# EasyEDA Pro project ProPrj_队内赛第二版_2024-09-21_20-05-29_2024-09-27.epro, schematic Schematic1
Board Name: Board1; Create Date: 2024-09-21
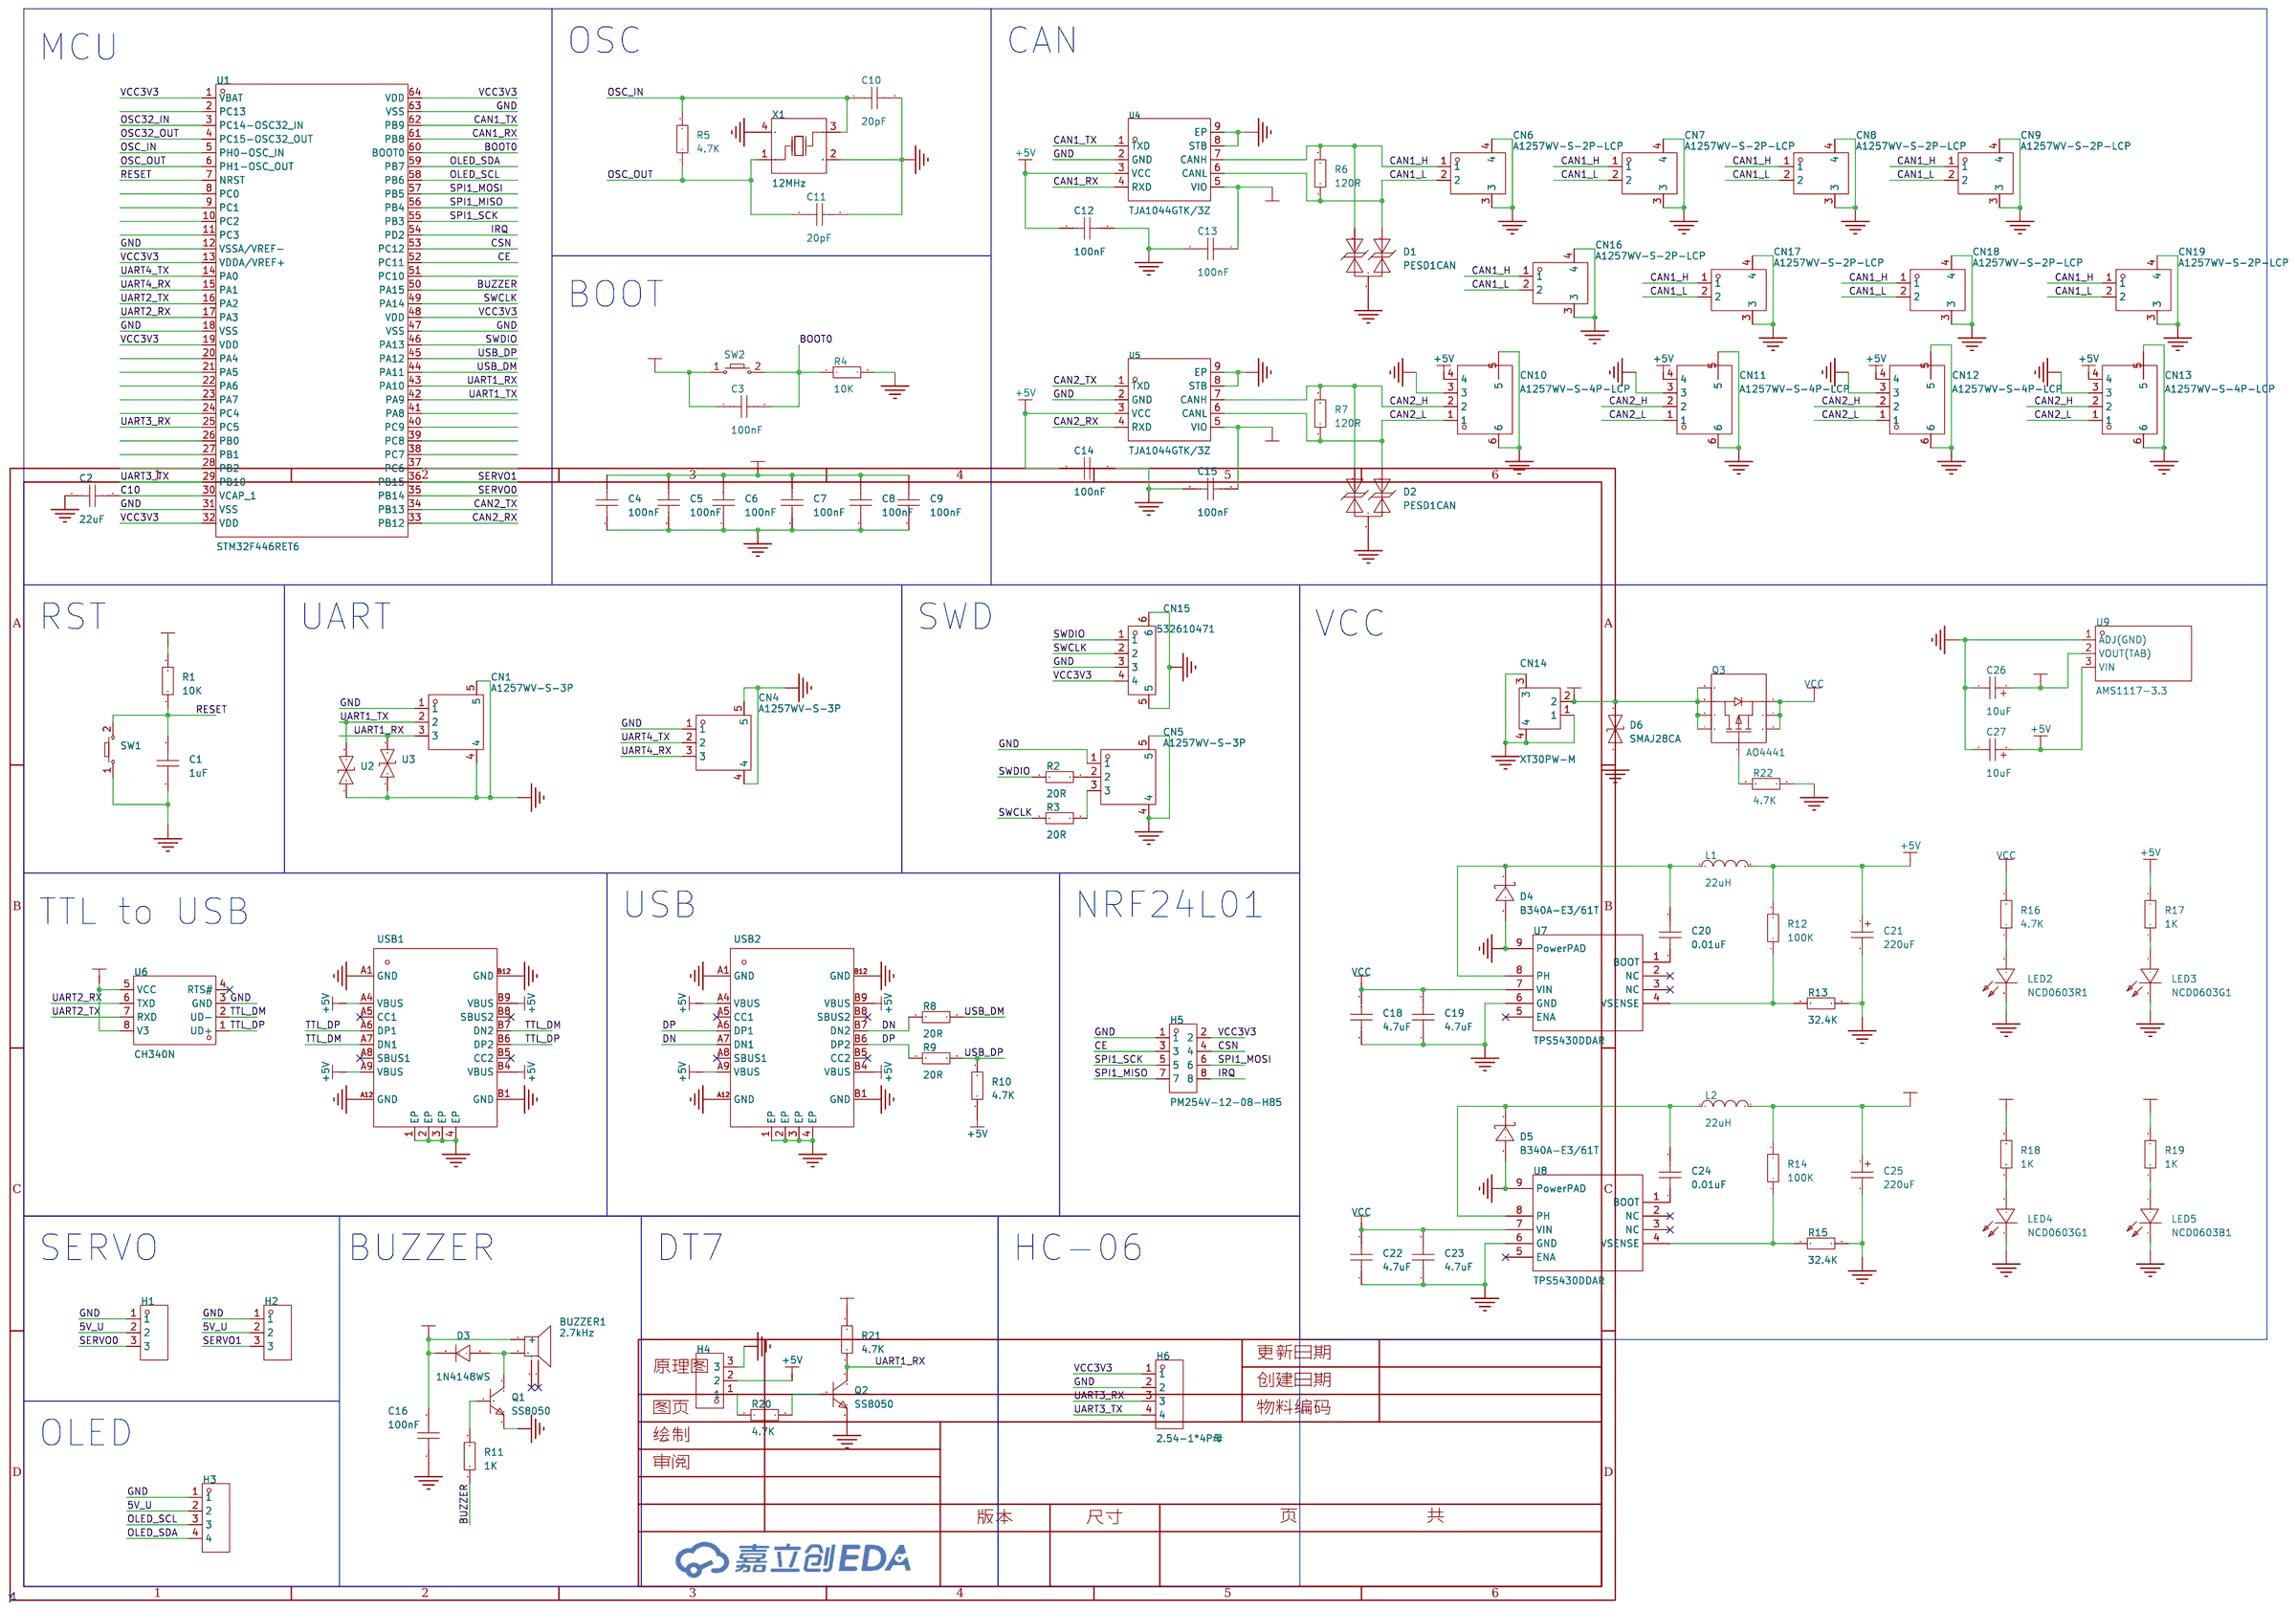
[diagram p0: schematic sheet]

## Parts
BUZZER1  2.7kHz  [BUZ-SMD_4P-L8.5-W8.5-P8.50-BR]
C1  1uF  [C0603]
C2  22uF  [C0603]
C3  100nF  [C0603]
C4  100nF  [C0603]
C5  100nF  [C0603]
C6  100nF  [C0603]
C7  100nF  [C0603]
C8  100nF  [C0603]
C9  100nF  [C0603]
C10  20pF  [C0603]
C11  20pF  [C0603]
C12  100nF  [C0603]
C13  100nF  [C0603]
C14  100nF  [C0603]
C15  100nF  [C0603]
C16  100nF  [C0603]
C18  4.7uF  [C0603]
C19  4.7uF  [C0603]
C20  0.01uF  [C0603]
C21  220uF  [CAP-SMD_BD6.3-L6.6-W6.6-FD]
C22  4.7uF  [C0603]
C23  4.7uF  [C0603]
C24  0.01uF  [C0603]
C25  220uF  [CAP-SMD_BD6.3-L6.6-W6.6-FD]
C26  10uF  [C0603]
C27  10uF  [C0603]
CN1  A1257WV-S-3P  [CONN-SMD_A1257WV-S-3P]
CN4  A1257WV-S-3P  [CONN-SMD_A1257WV-S-3P]
CN5  A1257WV-S-3P  [CONN-SMD_A1257WV-S-3P]
CN6  A1257WV-S-2P-LCP  [CONN-SMD_A1257WV-S-2P]
CN7  A1257WV-S-2P-LCP  [CONN-SMD_A1257WV-S-2P]
CN8  A1257WV-S-2P-LCP  [CONN-SMD_A1257WV-S-2P]
CN9  A1257WV-S-2P-LCP  [CONN-SMD_A1257WV-S-2P]
CN10  A1257WV-S-4P-LCP  [CONN-SMD_A1257WV-S-4P]
CN11  A1257WV-S-4P-LCP  [CONN-SMD_A1257WV-S-4P]
CN12  A1257WV-S-4P-LCP  [CONN-SMD_A1257WV-S-4P]
CN13  A1257WV-S-4P-LCP  [CONN-SMD_A1257WV-S-4P]
CN14  XT30PW-M  [CONN-TH_XT30PW-M]
CN15  532610471  [CONN-SMD_4P-P1.25_53261-0471]
CN16  A1257WV-S-2P-LCP  [CONN-SMD_A1257WV-S-2P]
CN17  A1257WV-S-2P-LCP  [CONN-SMD_A1257WV-S-2P]
CN18  A1257WV-S-2P-LCP  [CONN-SMD_A1257WV-S-2P]
CN19  A1257WV-S-2P-LCP  [CONN-SMD_A1257WV-S-2P]
D1  PESD1CAN  [SOT-23-3_L2.9-W1.6-P1.90-LS2.8-BR]
D2  PESD1CAN  [SOT-23-3_L2.9-W1.6-P1.90-LS2.8-BR]
D3  1N4148WS  [SOD-323_L1.8-W1.3-LS2.5-RD]
D4  B340A-E3/61T  [SMA_L4.3-W2.6-LS5.2-RD]
D5  B340A-E3/61T  [SMA_L4.3-W2.6-LS5.2-RD]
D6  SMAJ28CA  [SMA_L4.4-W2.6-LS5.0-BI]
H1  2.54-1*3P针  [HDR-TH_3P-P2.54-V-M-1]
H2  2.54-1*3P针  [HDR-TH_3P-P2.54-V-M-1]
H3  2.54-1*4P母  [HDR-TH_4P-P2.54-V-F]
H4  2.54-1*3P针  [HDR-TH_3P-P2.54-V-M-1]
H5  PM254V-12-08-H85  [HDR-TH_8P-P2.54-V-F-R2-C4-S2.54]
H6  2.54-1*4P母  [HDR-TH_4P-P2.54-V-F]
L1  22uH  [IND-SMD_L7.0-W6.6_FXL0630]
L2  22uH  [IND-SMD_L7.0-W6.6_FXL0630]
LED2  NCD0603R1  [LED0603-RD_RED]
LED3  NCD0603G1  [LED0603-RD_1]
LED4  NCD0603G1  [LED0603-RD_1]
LED5  NCD0603B1  [LED0603-RD]
Q1  SS8050  [SOT-23-3_L2.9-W1.3-P1.90-LS2.4-BR]
Q2  SS8050  [SOT-23-3_L2.9-W1.3-P1.90-LS2.4-BR]
Q3  AO4441  [SOIC-8_L4.9-W3.9-P1.27-LS6.0-BL]
R1  10K  [R0603]
R2  20R  [R0603]
R3  20R  [R0603]
R4  10K  [R0603]
R5  4.7K  [R0603]
R6  120R  [R0603]
R7  120R  [R0603]
R8  20R  [R0603]
R9  20R  [R0603]
R10  4.7K  [R0603]
R11  1K  [R0603]
R12  100K  [R0603]
R13  32.4K  [R0603]
R14  100K  [R0603]
R15  32.4K  [R0603]
R16  4.7K  [R0603]
R17  1K  [R0603]
R18  1K  [R0603]
R19  1K  [R0603]
R20  4.7K  [R0603]
R21  4.7K  [R0603]
R22  4.7K  [R0603]
SW1  -  [Key_SMD_3x4x2]
SW2  -  [Key_SMD_3x4x2]
U1  STM32F446RET6  [LQFP-64_L10.0-W10.0-P0.50-LS12.0-BL]
U2  ESD9B5.0ST5G  [SOD-923_L0.8-W0.6-LS1.0-BI]
U3  ESD9B5.0ST5G  [SOD-923_L0.8-W0.6-LS1.0-BI]
U4  TJA1044GTK/3Z  [HVSON-8_L3.0-W3.0-P0.65-BL-EP]
U5  TJA1044GTK/3Z  [HVSON-8_L3.0-W3.0-P0.65-BL-EP]
U6  CH340N  [SOP-8_L4.9-W3.9-P1.27-LS6.0-BL]
U7  TPS5430DDAR  [ESOP-8_L4.9-W3.9-P1.27-LS6.0-TL-EP]
U8  TPS5430DDAR  [ESOP-8_L4.9-W3.9-P1.27-LS6.0-TL-EP]
U9  AMS1117-3.3  [SOT-89_L4.5-W2.5-P1.50-LS4.2-BR]
USB1  -  [USB_TYPE-C-16P]
USB2  -  [USB_TYPE-C-16P]
X1  12MHz  [OSC-SMD_4P-L3.2-W2.5-BL]

## Library data of the parts
BUZZER1 = MLT-8530_C94599: 驱动方式:无源(外部驱动);构造类型:电磁式;频率:2.7kHz;声压(SPL):80dB@5V,10cm;; LCSC Part Name: MLT-8530; Supplier Part: C94599; Manufacturer: 华能; Manufacturer Part: MLT-8530; Supplier Footprint: SMD,8.5x8.5mm; JLCPCB Part Class: 扩展库; Datasheet: https://atta.szlcsc.com/upload/public/pdf/source/20170522/1495448322339.pdf; Supplier: LCSC; Oscillator Circuit: 无源(外部驱动); Technology Type: 电磁式; Operating Voltage: 2.5V~4.5V; Sound Pressure Level (SPL): 80dB@5V,10cm; Length: 8.5mm; Width: 8.5mm; Height: 3.3mm
C1-C16 C18-C20 C22-C24 = CAP_0603: Supplier Footprint: 0603
C21 C25 = RVT220UF16V67RV0015: 容值:220uF;精度:±20%;额定电压:16V;纹波电流:110mA@120Hz;等效串联电阻:-;; LCSC Part Name: 220uF ±20% 16V; Supplier Part: C2887273; Manufacturer: KNSCHA(科尼盛); Supplier Footprint: SMD,D6.3xL7.7mm; JLCPCB Part Class: Extended Part; Datasheet: https://atta.szlcsc.com/upload/public/pdf/source/20210824/3DC9999D9B098FE241E3A26137981C4C.pdf; Supplier: LCSC; Tolerance: ±20%; Rated Voltage: 16V; Ripple Current: 110mA@120Hz; φD: 6.3mm; L: 7.7mm; Lifetime @ Temp: 2000hrs@105℃; Operating Temperature: -55℃~+105℃
C26 C27 = CL10A106KP8NNNC: 容值:10uF;精度:±10%;额定电压:10V;材质(温度系数):X5R;; LCSC Part Name: 10uF ±10% 10V; Supplier Part: C19702; Manufacturer: SAMSUNG(三星); Supplier Footprint: 0603; JLCPCB Part Class: Basic Part; Datasheet: https://atta.szlcsc.com/upload/public/pdf/source/20160218/1457707763339.pdf; Supplier: LCSC; Tolerance: ±10%; Voltage Rated: 10V; Temperature Coefficient: X5R
CN1 CN4 CN5 = A1257WV-S-3P: 插针结构:1x3P;间距:1.25mm;安装方式:-;参考系列:GH;总PIN数:3P;排数:1;每排PIN数:3;行距:-;触头材质:黄铜;; LCSC Part Name: 系列:GH 间距:1.25mm 1x3P; Supplier Part: C225119; Manufacturer: CJT(长江连接器); Supplier Footprint: SMD,P=1.25mm; JLCPCB Part Class: 扩展库; Datasheet: https://atta.szlcsc.com/upload/public/pdf/source/20181008/C272994_C9E89FA8A36D0009CAD30AD8C59C2782.pdf; Supplier: LCSC; Pins Structure: 1x3P; Pitch: 1.25mm; Reference Series: GH; Number of Pins: 3P; Number of Rows: 1; Number of PINs Per Row: 3; Contact Material: 黄铜
CN6-CN9 CN16-CN19 = A1257WV-S-2P-LCP: 插针结构:1x2P;间距:1.25mm;安装方式:-;参考系列:GH;总PIN数:2P;排数:1;每排PIN数:2;行距:-;触头材质:黄铜;; LCSC Part Name: 系列:GH 间距:1.25mm 1x2P; Supplier Part: C225118; Manufacturer: CJT(长江连接器); Supplier Footprint: SMD,P=1.25mm; JLCPCB Part Class: Extended Part; Datasheet: https://atta.szlcsc.com/upload/public/pdf/source/20181008/C272994_C9E89FA8A36D0009CAD30AD8C59C2782.pdf; Supplier: LCSC; Pins Structure: 1x2P; Pitch: 1.25mm; Reference Series: GH; Number of Pins: 2P; Number of Rows: 1; Number of PINs Per Row: 2; Contact Material: 黄铜
CN10-CN13 = A1257WV-S-4P-LCP: 插针结构:1x4P;间距:1.25mm;安装方式:-;参考系列:GH;总PIN数:4P;排数:1;每排PIN数:4;行距:-;触头材质:黄铜;; LCSC Part Name: 系列:GH 间距:1.25mm 1x4P; Supplier Part: C225120; Manufacturer: CJT(长江连接器); Supplier Footprint: SMD,P=1.25mm; JLCPCB Part Class: Extended Part; Datasheet: https://atta.szlcsc.com/upload/public/pdf/source/20181008/C272994_C9E89FA8A36D0009CAD30AD8C59C2782.pdf; Supplier: LCSC; Pins Structure: 1x4P; Pitch: 1.25mm; Reference Series: GH; Number of Pins: 4P; Number of Rows: 1; Number of PINs Per Row: 4; Contact Material: 黄铜
CN14 = XT30PW-M: 类别:-;类型1:-;; LCSC Part Name: AMASS(艾迈斯)航模插头 卧式弯脚 XT30PW-M公头; Supplier Part: C431092; Manufacturer: AMASS(艾迈斯); JLCPCB Part Class: 扩展库; Datasheet: https://atta.szlcsc.com/upload/public/pdf/source/20220222/6A9F22F7850E25B33E1BE430ADF8560B.pdf; Supplier: LCSC; Brand: 艾迈斯; Type: 航模插头; RatedVoltage: DC 500V; InterfaceType: 公头; RatedCurrent: 15A; RecommendedWireGauge: 16/18/20AWG; contact resistance: 1.2mΩ; specifications: 2pin
CN15 = 532610471_C696092: 插针结构:1x4P;间距:1.25mm;安装方式:卧贴;参考系列:PicoBlade(MX 1.25);总PIN数:4P;排数:1;每排PIN数:4;行距:-;额定电流:1A;触头材质:磷青铜;触头镀层:锡;工作温度范围:-40℃~+105℃;; LCSC Part Name: 1x4P 间距:1.25mm 卧贴 系列:PicoBlade(MX 1.25); Supplier Part: C696092; Manufacturer: MOLEX; Supplier Footprint: SMD,P=1.25mm; JLCPCB Part Class: 扩展库; Datasheet: https://www.molex.com/content/dam/molex/molex-dot-com/products/automated/en-us/salesdrawingpdf/532/53261/532610471_sd.pdf?inline; Supplier: LCSC; Pins Structure: 1x4P; Pitch: 1.25mm; Mounting Style: 卧贴; Reference Series: PicoBlade(MX 1.25); Number of Pins: 4P; Number of Rows: 1; Number of PINs Per Row: 4; Current Rating (Max): 1A; Contact Material: 磷青铜; Contact Plating: 锡; Operating Temperature Range: -40℃~+105℃; Rated Voltage (Max): 125V; Plastic Material: 玻纤增强PA; Flame Retardant Rating: UL94V-0; Supplementary Features: 辅助焊脚; Colour: 白色; Z-Height of the Board: 3.4mm; X-Length of Bottom Edge on Board (Spacing Line): 10.15mm; Y-Width of Bottom Edge on Board: 5.2mm
D1 D2 = PESD1CAN_C343993: 极性:双向;反向截止电压(Vrwm):24V;最大钳位电压:48V;峰值脉冲电流(Ipp)@10/1000us:6A;击穿电压:26.7V;; LCSC Part Name: 双向ESD; Supplier Part: C343993; Manufacturer: BORN(伯恩半导体); Supplier Footprint: SOT-23; JLCPCB Part Class: 扩展库; Datasheet: https://atta.szlcsc.com/upload/public/pdf/source/20181211/C343993_AF595724ADB82F42A1C256C97FD7AD6B.pdf; Supplier: LCSC; polarity: 双向; Reverse Stand-Off Voltage (Vrwm): 24V; Maximum Clamping Voltage: 48V; Peak Pulse Current (Ipp)@10/1000us: 6A; Breakdown Voltage: 26.7V; Type: ESD
D3 = 1N4148WS_C2128: 二极管配置:独立式;正向压降(Vf):1.25V@150mA;直流反向耐压(Vr):100V;平均整流电流(Io):150mA;功率:200mW;反向恢复时间(trr):4ns;; LCSC Part Name: 电压:100V 电流:150mA; Supplier Part: C2128; Manufacturer: CJ(江苏长电/长晶); Supplier Footprint: SOD-323; JLCPCB Part Class: 基础库; Datasheet: https://atta.szlcsc.com/upload/public/pdf/source/20140809/1457707208178.pdf; Supplier: LCSC; Diode Configuration: 独立式; Forward Voltage (Vf@If): 1.25V@150mA; Reverse Voltage (Vr): 100V; Average Rectified Current (Io): 150mA; Power Dissipation: 200mW; Reverse Leakage Current: 1uA@75V; Reverse Recovery Time (trr): 4ns
D4 D5 = B340A-E3/61T: 正向压降(Vf):550mV@3A;直流反向耐压(Vr):40V;平均整流电流(Io):3A;; LCSC Part Name: 电压:40V 电流:3A; Supplier Part: C15570; Manufacturer: VISHAY(威世); Supplier Footprint: SMA(DO-214AC); JLCPCB Part Class: 扩展库; Datasheet: https://atta.szlcsc.com/upload/public/pdf/source/20130720/1457706624701.pdf; Supplier: LCSC; Forward Voltage (Vf@If): 550mV@3A; Reverse Voltage (Vr): 40V; Average Rectified Current (Io): 3A; Reverse Leakage Current (Ir): 500uA@40V
D6 = SMAJ28CA_C148228: 反向截止电压(Vrwm):28V;最大钳位电压:45.4V;峰值脉冲电流(Ipp)@10/1000us:8.8A;峰值脉冲功率(Ppp)@10/1000us:400W;击穿电压:31.1V;; LCSC Part Name: 双向TVS 28V截止 8.8A峰值脉冲; Supplier Part: C148228; Manufacturer: Littelfuse(美国力特); Supplier Footprint: SMA(DO-214AC); JLCPCB Part Class: 扩展库; Datasheet: https://atta.szlcsc.com/upload/public/pdf/source/20190402/C374025_5ACE77BC72947DF13CF0CBC7F8B57228.pdf; Supplier: LCSC; Reverse Stand-Off Voltage (Vrwm): 28V; Maximum Clamping Voltage: 45.4V; Peak Pulse Current (Ipp)@10/1000us: 8.8A; Peak Pulse Power Dissipation (Ppp)@10/1000us: 400W; Breakdown Voltage: 31.1V; Type: TVS
H1 H2 H4 = 2.54-1*3P针: 插针结构:1x3P;间距:2.54mm;行距:-;圆针/方针:方针;安装类型:直插;排数:单排;总PIN位数:3P;额定电流:3A;额定电压:-;配合针长度:-;塑高:-;端接针长度:-;触头材质:-;触头镀层:-;工作温度范围:-40℃~+105℃;颜色:黑色;; LCSC Part Name: 间距:2.54mm 1x3P 直插 方针; Supplier Part: C49257; Manufacturer: BOOMELE(博穆精密); Supplier Footprint: 插件,P=2.54mm; JLCPCB Part Class: Extended Part; Datasheet: https://atta.szlcsc.com/upload/public/pdf/source/20221018/3E9408392E35E6F57A28985E5F7BF5C9.pdf; Supplier: LCSC; Pin Structure: 1x3P; Pitch: 2.54mm; Circluar Pins/Square Pins: 方针; Mounting Type: 直插; Number of Rows: 单排; Number of Pins: 3P; Current Rating (Max): 3A; Operating Temperature Range: -40℃~+105℃; Color: 黑色
H3 = 2.54-1*4P母: 插孔结构:1x4P;间距:2.54mm;行距:-;圆孔/方孔:方孔;安装类型:直插;排数:单排;总孔位数:4P;额定电流:3A;额定电压:-;插孔方向:顶部;塑高:-;触头材质:青铜;触头镀层:-;工作温度范围:-40℃~+105℃;焊接温度(最大值):-;; LCSC Part Name: 间距:2.54mm 1x4P 直插; Supplier Part: C2718488; Manufacturer: BOOMELE(博穆精密); Supplier Footprint: 插件,P=2.54mm; JLCPCB Part Class: Extended Part; Datasheet: https://atta.szlcsc.com/upload/public/pdf/source/20210301/C2718488_F4427B881E42CAA8DDB0B1C12B3A522C.pdf; Supplier: LCSC; Holes Structure: 1x4P; Pitch: 2.54mm; Circular Hole / Square Hole: 方孔; Mounting Type: 直插; Number of Rows: 单排; Number of Holes: 4P; Current Rating (Max): 3A; Holes Direction: 顶部; Contact Material: 青铜; Operating Temperature Range: -40℃~+105℃; Pin Structure: 1x4P; Circluar Pins/Square Pins: 方针; Number of Pins: 4P; Length of Mating Pin: 6mm; Length of End Connection Pin: 3mm; Color: 黑色
H5 = PM254V-12-08-H85: 插孔结构:2x4P;间距:2.54mm;行距:2.54mm;圆孔/方孔:方孔;安装类型:直插;排数:双排;总孔位数:8P;额定电流:3A;额定电压:250V;插孔方向:顶部;塑高:8.5mm;工作温度范围:-40℃~+105℃;; LCSC Part Name: 间距:2.54mm 2x4P 直插; Supplier Part: C2834799; Manufacturer: XFCN(兴飞); Supplier Footprint: 插件,P=2.54mm; JLCPCB Part Class: Extended Part; Datasheet: https://atta.szlcsc.com/upload/public/pdf/source/20200309/C492399_8C441E2934FBB604A89B37A68AA45ECF.pdf; Supplier: LCSC; Holes Structure: 2x4P; Pitch: 2.54mm; Row Spacing: 2.54mm; Circular Hole / Square Hole: 方孔; Mounting Type: 直插; Number of Rows: 双排; Number of Holes: 8P; Current Rating (Max): 3A; Voltage Rating (Max): 250V; Holes Direction: 顶部; Insulation Height: 8.5mm; Operating Temperature Range: -40℃~+105℃; Contact Material: 铜合金; Soldering Temperature(Max): 260℃@5S
H6 = 2.54-1*4P母: 插孔结构:1x4P;间距:2.54mm;行距:-;圆孔/方孔:方孔;安装类型:直插;排数:单排;总孔位数:4P;额定电流:3A;额定电压:-;插孔方向:顶部;塑高:-;触头材质:青铜;触头镀层:-;工作温度范围:-40℃~+105℃;焊接温度(最大值):-;; LCSC Part Name: 间距:2.54mm 1x4P 直插; Supplier Part: C2718488; Manufacturer: BOOMELE(博穆精密); Supplier Footprint: 插件,P=2.54mm; JLCPCB Part Class: 扩展库; Datasheet: https://atta.szlcsc.com/upload/public/pdf/source/20210301/C2718488_F4427B881E42CAA8DDB0B1C12B3A522C.pdf; Supplier: LCSC; Holes Structure: 1x4P; Pitch: 2.54mm; Circular Hole / Square Hole: 方孔; Mounting Type: 直插; Number of Rows: 单排; Number of Holes: 4P; Current Rating (Max): 3A; Holes Direction: 顶部; Contact Material: 青铜; Operating Temperature Range: -40℃~+105℃
L1 L2 = FXL0630-220-M: 电感值:22uH;精度:±20%;额定电流:2.5A;饱和电流(Isat):3A;类型:一体成型电感;; LCSC Part Name: 22uH ±20% 3A; Supplier Part: C177244; Manufacturer: cjiang(长江微电); Supplier Footprint: SMD,6.6x7mm; JLCPCB Part Class: 扩展库; Datasheet: https://atta.szlcsc.com/upload/public/pdf/source/20240426/3189EA8206330E2108542F9E34E540E7.pdf; Supplier: LCSC; Tolerance: ±20%; Rated Current: 2.5A; Saturation Current (Isat): 3A; DC Resistance (DCR): 200mΩ; Type: 一体成型电感
LED2 = NCD0603R1_C84263: 灯头类型:-;发光颜色:红色;正向电压(VF):1.6V~2.6V;功率:65mW;正向电流:20mA;主波长:615nm~630nm;二极管配置:独立二极管;透镜颜色:无色透明透镜;色温:-;发光强度:80mcd~220mcd;发光角度:130°;载带方式:-;工作温度:-30℃~+85℃;; Supplier Part: C84263; Manufacturer: 国星光电; Supplier Footprint: 0603; JLCPCB Part Class: Extended Part; Datasheet: https://atta.szlcsc.com/upload/public/pdf/source/20200820/C84263_DABC6A75E58F576973B407FDBA283D60.pdf; Supplier: LCSC; Emitted Color: 红色; Forward Voltage (VF): 1.6V~2.6V; Power Dissipation: 65mW; Forward Current: 20mA; Dominant Wavelength: 615nm~630nm; Diode Configuration: 独立二极管; Lens Color: 无色透明透镜; Luminous Intensity: 80mcd~220mcd; Viewing Angle: 130°; Operating Temperature: -30℃~+85℃
LED3 LED4 = NCD0603G1: 发光颜色:翠绿色;正向电压(VF):2.6V~3.6V;功率:72mW;正向电流:10mA;主波长:515nm~530nm;透镜颜色:无色透明透镜;发光强度:330mcd~900mcd;发光角度:130°;工作温度:-30℃~+85℃;; Supplier Part: C84267; Manufacturer: 国星光电; Supplier Footprint: 0603; JLCPCB Part Class: Extended Part; Datasheet: https://atta.szlcsc.com/upload/public/pdf/source/20200820/C84267_04BA7703640BAC111D09F5EFB971FBF3.pdf; Supplier: LCSC; Emitted Color: 翠绿色; Forward Voltage (VF): 2.6V~3.6V; Power Dissipation: 72mW; Forward Current: 10mA; Dominant Wavelength: 515nm~530nm; Lens Color: 无色透明透镜; Luminous Intensity: 330mcd~900mcd; Viewing Angle: 130°; Operating Temperature: -30℃~+85℃; Diode Configuration: 独立二极管
LED5 = NCD0603B1: 发光颜色:蓝色;正向电压(VF):2.6V~3.6V;功率:72mW;正向电流:10mA;主波长:463nm~475nm;透镜颜色:无色透明透镜;发光强度:80mcd~220mcd;发光角度:130°;工作温度:-30℃~+85℃;; Supplier Part: C84266; Manufacturer: 国星光电; Supplier Footprint: 0603; JLCPCB Part Class: Extended Part; Datasheet: https://atta.szlcsc.com/upload/public/pdf/source/20200820/C84266_6A3CDBEFA72C6CAD68EDA53474ADAE6C.pdf; Supplier: LCSC; Emitted Color: 蓝色; Forward Voltage (VF): 2.6V~3.6V; Power Dissipation: 72mW; Forward Current: 10mA; Dominant Wavelength: 463nm~475nm; Lens Color: 无色透明透镜; Luminous Intensity: 80mcd~220mcd; Viewing Angle: 130°; Operating Temperature: -30℃~+85℃; Diode Configuration: 独立二极管
Q1 Q2 = SS8050_C2150: 晶体管类型:NPN;集电极电流(Ic):1.5A;集射极击穿电压(Vceo):25V;功率(Pd):300mW;直流电流增益(hFE@Ic,Vce):200@100mA,1V;; LCSC Part Name: SS8050(RANGE:200-350) hfe=200~350; Supplier Part: C2150; Manufacturer: CJ(江苏长电/长晶); Supplier Footprint: SOT-23; JLCPCB Part Class: 基础库; Datasheet: https://atta.szlcsc.com/upload/public/pdf/source/20230322/AEE86F4B043774EFF80CAEA14A37D9E9.pdf; Supplier: LCSC; Transistor Type: NPN; Collector Current (Ic): 1.5A; Collector-Emitter Breakdown Voltage (Vceo): 25V; Power Dissipation (Pd): 300mW; DC Current Gain (hFE@Ic,Vce): 200@100mA,1V; Transition Frequency (fT): 100MHz; Collector Cut-Off Current (Icbo): 100nA; Collector-Emitter Saturation Voltage (VCE(sat)@Ic,Ib): 500mV@800mA,80mA
Q3 = AO4441_C22199: 类型:P沟道;漏源电压(Vdss):60V;连续漏极电流(Id):4A;功率(Pd):3.1W;导通电阻(RDS(on)@Vgs,Id):100mΩ@10V,4A;阈值电压(Vgs(th)@Id):3V@250uA;; LCSC Part Name: P沟道 耐压:60V 电流:4A; Supplier Part: C22199; Manufacturer: AOS; Supplier Footprint: SOIC-8; JLCPCB Part Class: 扩展库; Datasheet: https://atta.szlcsc.com/upload/public/pdf/source/20150518/1457707310050.pdf; Supplier: LCSC; Type: P沟道; Drain Source Voltage (Vdss): 60V; Continuous Drain Current (Id): 4A; Power Dissipation (Pd): 3.1W; Drain Source On Resistance (RDS(on)@Vgs,Id): 100mΩ@10V,4A; Gate Threshold Voltage (Vgs(th)@Id): 3V@250uA; Total Gate Charge (Qg@Vgs): 20nC@10V; Input Capacitance (Ciss@Vds): 1.12nF@30V; Operating Temperature: -55℃~+150℃@(Tj)
R1-R22 = Res_0603: Supplier Footprint: 0603
SW1 SW2 = Key_SMD_3x4x2: Supplier Footprint: SMD
U1 = STM32F446RET6: CPU内核:CM4;程序存储容量:512KB;RAM总容量:128KB;GPIO端口数量:50;工作电压范围:1.7V~3.6V;CPU最大主频:180MHz;程序存储器类型:FLASH;; LCSC Part Name: STM32F446RET6 MSL=3; Supplier Part: C69336; Manufacturer: ST(意法半导体); Supplier Footprint: LQFP-64(10x10); JLCPCB Part Class: 扩展库; Datasheet: https://atta.szlcsc.com/upload/public/pdf/source/20170518/1495086068896.pdf; Supplier: LCSC; CPU Core: CM4; Program Storage Size: 512KB; RAM Size: 128KB; GPIO Ports Number: 50; Operating Voltage Range: 1.7V~3.6V; CPU Maximum Speed: 180MHz; Program Memory Type: FLASH; Operating Temperature Range: -40℃~+85℃; ADC (Bit): 12bit; DAC (Bit): 12bit; Universal Serial Bus: 有; Peripheral/Function: PWM；PWM；低电压检测; Watchdog: 有; Infrared Data Association: 有; Low-Voltage Detect: 有; Direct Memory Access: 有; Internal Oscillator: 有
U2 U3 = ESD9B5.0ST5G_C3021104: Supplier Part: C3021104; Manufacturer: TECH PUBLIC(台舟); Supplier Footprint: SOD-923; JLCPCB Part Class: 扩展库; Datasheet: https://atta.szlcsc.com/upload/public/pdf/source/20220524/6CC5EA9A5BA15BBB56040E503B840966.pdf; Supplier: LCSC
U4 U5 = TJA1044GTK/3Z: 类型:-;; Supplier Part: C2157795; Manufacturer: NXP(恩智浦); Supplier Footprint: HVSON-8-EP(3x3); JLCPCB Part Class: 扩展库; Datasheet: https://atta.szlcsc.com/upload/public/pdf/source/20180227/C181725_15196977259441370130.pdf; Supplier: LCSC
U6 = CH340N: LCSC Part Name: USB转串口芯片 CH340; Supplier Part: C2977777; Manufacturer: WCH(南京沁恒); Supplier Footprint: SOP-8; JLCPCB Part Class: 扩展库; Datasheet: https://atta.szlcsc.com/upload/public/pdf/source/20230530/6E401E9554E9F5311886CC8B3F89B62E.pdf; Supplier: LCSC
U7 U8 = TPS5430DDAR: 功能类型:降压型;输出类型:可调;输入电压:5.5V~36V;输出电压:1.221V~32.04V;输出电流(最大值):3A;; LCSC Part Name: 降压 3A 36V; Supplier Part: C9864; Manufacturer: TI(德州仪器); Supplier Footprint: SOIC-8-EP; JLCPCB Part Class: 基础库; Datasheet: https://www.ti.com/cn/lit/gpn/tps5430; Supplier: LCSC; Function: 降压型; Output Type: 可调; Input Voltage: 5.5V~36V; Output Voltage: 1.221V~32.04V; Output Current (Max): 3A; Switching Frequency: 500kHz; Operating Temperature: -40℃~+125℃@(TJ); Synchronous Rectification: 否; Number of Outputs: 1; Topology: 降压式; Switch tube (built-in/external): 内置
U9 = AMS1117-3.3_C347256: 输出类型:固定;最大输入电压:12V;输出电压:3.3V;最大输出电流:1A;电源纹波抑制比(PSRR):60dB@(120Hz);输出极性:正极;; LCSC Part Name: 输出:3.3V 电流:1A 耐压:12V; Supplier Part: C347256; Manufacturer: UMW(友台半导体); Supplier Footprint: SOT-89; JLCPCB Part Class: 扩展库; Datasheet: https://atta.szlcsc.com/upload/public/pdf/source/20231109/155D79A26D9DB04352555A58D5969DC8.pdf; Supplier: LCSC; Output Type: 固定; Maximum Input Voltage: 12V; Output Voltage: 3.3V; MAX Output Current: 1A; Power Supply Rejection Ratio (PSRR): 60dB@(120Hz); Dropout Voltage: 1.3V@(1A); Output Polarity: 正极; Number of Outputs: 1
USB1 USB2 = USB_TYPE-C-16P: Supplier Footprint: SMD
X1 = X322512MSB4SI: 晶振类型:贴片晶振;频率:12MHz;常温频差:±10ppm;外接负载电容:20pF;频率稳定度(全温):±20ppm;; LCSC Part Name: 12MHz ±10ppm 20pF; Supplier Part: C9002; Manufacturer: YXC(扬兴晶振); Supplier Footprint: SMD3225-4P; JLCPCB Part Class: 基础库; Datasheet: https://atta.szlcsc.com/upload/public/pdf/source/20240329/19D5F850207469550BEB00D7DFEDBC7A.pdf; Supplier: LCSC; Crystal Type: 贴片晶振; Normal temperature Frequency Tolerance: ±10ppm; External load capacitor: 20pF; Frequency Stability(Full temperature range): ±20ppm; Operating Temperature: -40℃~+85℃

## Nets
5V_U: C25.1 H1.2 H2.2 H3.2 L2.2 R14.2 R18.2
+5V: C12.2 C14.2 C21.1 C27.1 CN10.4 CN11.4 CN12.4 CN13.4 H4.2 L1.2 R10.1 R12.2 R17.2 U4.3(VCC) U5.3(VCC) U9.3(VIN) USB1.A4(VBUS) USB1.A9(VBUS) USB1.B4(VBUS) USB1.B9(VBUS) USB2.A4(VBUS) USB2.A9(VBUS) USB2.B4(VBUS) USB2.B9(VBUS)
GND: C1.2 C2.1 C4.1 C5.1 C6.1 C7.1 C8.1 C9.1 C10.2 C11.2 C12.1 C13.2 C14.1 C15.2 C16.1 C18.1 C19.1 C21.2 C22.1 C23.1 C25.2 C26.2 C27.2 CN1.1 CN1.4 CN1.5 CN4.1 CN4.4 CN4.5 CN5.1 CN5.4 CN5.5 CN6.3 CN6.4 CN7.3 CN7.4 CN8.3 CN8.4 CN9.3 CN9.4 CN10.3 CN10.5 CN10.6 CN11.3 CN11.5 CN11.6 CN12.3 CN12.5 CN12.6 CN13.3 CN13.5 CN13.6 CN14.1 CN14.3 CN14.4 CN15.3 CN15.5 CN15.6 CN16.3 CN16.4 CN17.3 CN17.4 CN18.3 CN18.4 CN19.3 CN19.4 D1.3(A) D2.3(A) D4.2(A) D5.2(A) D6.1 H1.1 H2.1 H3.1 H4.3 H5.1 H6.2 LED2.2(-) LED3.2(-) LED4.2(-) LED5.2(-) Q1.2(E) Q2.2(E) R4.2 R13.1 R15.1 R22.1 SW1.1 U1.12(VSSA/VREF-) U1.18(VSS) U1.31(VSS) U1.47(VSS) U1.63(VSS) U2.1 U3.1 U4.2(GND) U4.8(STB) U4.9(EP) U5.2(GND) U5.8(STB) U5.9(EP) U6.3(GND) U7.6(GND) U7.9(PowerPAD) U8.6(GND) U8.9(PowerPAD) U9.1(ADJ(GND)) USB1.1(EP) USB1.2(EP) USB1.3(EP) USB1.4(EP) USB1.A1(GND) USB1.A12(GND) USB1.B1(GND) USB1.B12(GND) USB2.1(EP) USB2.2(EP) USB2.3(EP) USB2.4(EP) USB2.A1(GND) USB2.A12(GND) USB2.B1(GND) USB2.B12(GND) X1.2(GND) X1.4(GND)
VCC: C18.2 C19.2 C22.2 C23.2 Q3.1(S) Q3.2(S) Q3.3(S) R16.2 U7.7(VIN) U8.7(VIN)
VCC3V3: BUZZER1.1(+) C3.1 C4.2 C5.2 C6.2 C7.2 C8.2 C9.2 C13.1 C15.1 C16.2 C26.1 CN15.4 D3.1(K) H5.2 H6.1 R1.2 R19.2 R21.2 SW2.1 U1.1(VBAT) U1.13(VDDA/VREF+) U1.19(VDD) U1.32(VDD) U1.48(VDD) U1.64(VDD) U4.5(VIO) U5.5(VIO) U6.5(VCC) U6.8(V3) U9.2(VOUT(TAB))
BAT: CN14.2 D6.2 Q3.5(D) Q3.6(D) Q3.7(D) Q3.8(D)
BOOT0: C3.2 R4.1 SW2.2 U1.60(BOOT0)
BUZZER: R11.1 U1.50(PA15)
C10: C2.2 U1.30(VCAP_1)
CAN1_H: CN6.1 CN7.1 CN8.1 CN9.1 CN16.1 CN17.1 CN18.1 CN19.1 D1.2(K) R6.2 U4.7(CANH)
CAN1_L: CN6.2 CN7.2 CN8.2 CN9.2 CN16.2 CN17.2 CN18.2 CN19.2 D1.1(K) R6.1 U4.6(CANL)
CAN1_RX: U1.61(PB8) U4.4(RXD)
CAN1_TX: U1.62(PB9) U4.1(TXD)
CAN2_H: CN10.2 CN11.2 CN12.2 CN13.2 D2.2(K) R7.2 U5.7(CANH)
CAN2_L: CN10.1 CN11.1 CN12.1 CN13.1 D2.1(K) R7.1 U5.6(CANL)
CAN2_RX: U1.33(PB12) U5.4(RXD)
CAN2_TX: U1.34(PB13) U5.1(TXD)
CE: H5.3 U1.52(PC11)
CSN: H5.4 U1.53(PC12)
DN: R8.1 USB2.A7(DN1) USB2.B7(DN2)
DP: R9.1 USB2.A6(DP1) USB2.B6(DP2)
IRQ: H5.8 U1.54(PD2)
OLED_SCL: H3.3 U1.58(PB6)
OLED_SDA: H3.4 U1.59(PB7)
OSC32_IN: U1.3(PC14-OSC32_IN)
OSC32_OUT: U1.4(PC15-OSC32_OUT)
OSC_IN: C10.1 R5.2 U1.5(PH0-OSC_IN) X1.3(OSC2)
OSC_OUT: C11.1 R5.1 U1.6(PH1-OSC_OUT) X1.1(OSC1)
RESET: C1.1 R1.1 SW1.2 U1.7(NRST)
SERVO0: H1.3 U1.35(PB14)
SERVO1: H2.3 U1.36(PB15)
SPI1_MISO: H5.7 U1.56(PB4)
SPI1_MOSI: H5.6 U1.57(PB5)
SPI1_SCK: H5.5 U1.55(PB3)
SWCLK: CN15.2 R3.1 U1.49(PA14)
SWDIO: CN15.1 R2.1 U1.46(PA13)
TTL_DM: U6.2(UD-) USB1.A7(DN1) USB1.B7(DN2)
TTL_DP: U6.1(UD+) USB1.A6(DP1) USB1.B6(DP2)
UART1_RX: CN1.3 Q2.3(C) R21.1 U1.43(PA10) U3.2
UART1_TX: CN1.2 U1.42(PA9) U2.2
UART2_RX: U1.17(PA3) U6.6(TXD)
UART2_TX: U1.16(PA2) U6.7(RXD)
UART3_RX: H6.3 U1.25(PC5)
UART3_TX: H6.4 U1.29(PB10)
UART4_RX: CN4.3 U1.15(PA1)
UART4_TX: CN4.2 U1.14(PA0)
USB_DM: R8.2 U1.44(PA11)
USB_DP: R9.2 R10.2 U1.45(PA12)
$1N4999: CN5.2 R2.2
$1N5000: CN5.3 R3.2
$1N5113: BUZZER1.2 D3.2(A) Q1.3(C)
$1N5118: Q1.1(B) R11.2
$1N5172: C20.1 U7.1(BOOT)
$1N5173: C20.2 D4.1(K) L1.1 U7.8(PH)
$1N5178: R12.1 R13.2 U7.4(VSENSE)
$1N5180: C24.1 U8.1(BOOT)
$1N5181: C24.2 D5.1(K) L2.1 U8.8(PH)
$1N5186: R14.1 R15.2 U8.4(VSENSE)
$1N5187: LED2.1(+) R16.1
$1N5190: LED3.1(+) R17.1
$1N5193: LED4.1(+) R18.1
$1N5196: LED5.1(+) R19.1
$1N5202: Q2.1(B) R20.2
$1N5203: H4.1 R20.1
$1N5213: Q3.4(G) R22.2

Not connected (* = marked no-connect by the designer): BUZZER1 3* 4*; U1 2(PC13) 8(PC0) 9(PC1) 10(PC2) 11(PC3) 20(PA4) 21(PA5) 22(PA6) 23(PA7) 24(PC4) 26(PB0) 27(PB1) 28(PB2) 37(PC6) 38(PC7) 39(PC8) 40(PC9) 41(PA8) 51(PC10); U6 4(RTS#)*; U7 2(NC)* 3(NC)* 5(ENA)*; U8 2(NC)* 3(NC)* 5(ENA)*; USB1 A5(CC1)* A8(SBUS1)* B5(CC2)* B8(SBUS2)*; USB2 A5(CC1)* A8(SBUS1)* B5(CC2)* B8(SBUS2)*

## Notes on the sheet
- MCU
- OSC
- CAN
- BOOT
- RST
- UART
- SWD
- VCC
- USB
- NRF24L01
- TTL to USB
- SERVO
- BUZZER
- DT7
- HC-06
- OLED
